# EAGLE design board (EAGLE 9.6.2)
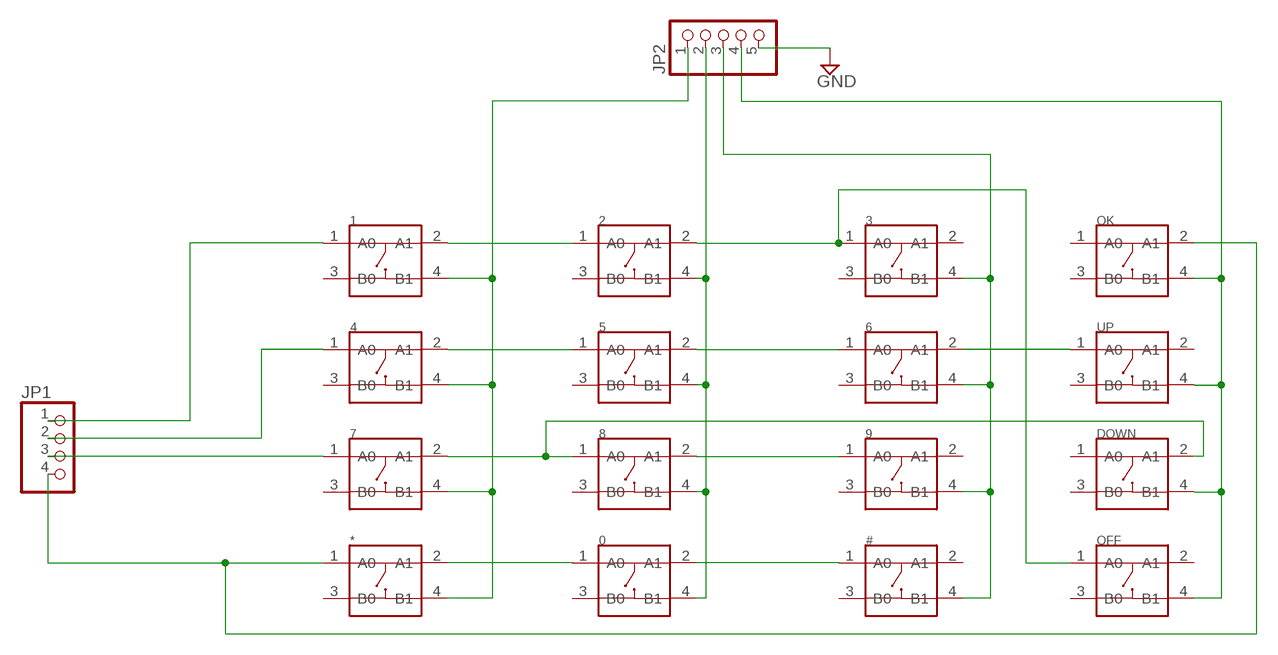
[diagram p0: schematic, sheet 1]

## Parts
0  SMD-BUTTON(4P-4.0X4.0X1.7MM)-DHT-1152  [SW4-SMD-4.0X4.0X1.7MM]
1  SMD-BUTTON(4P-4.0X4.0X1.7MM)-DHT-1152  [SW4-SMD-4.0X4.0X1.7MM]
2  SMD-BUTTON(4P-4.0X4.0X1.7MM)-DHT-1152  [SW4-SMD-4.0X4.0X1.7MM]
3  SMD-BUTTON(4P-4.0X4.0X1.7MM)-DHT-1152  [SW4-SMD-4.0X4.0X1.7MM]
4  SMD-BUTTON(4P-4.0X4.0X1.7MM)-DHT-1152  [SW4-SMD-4.0X4.0X1.7MM]
5  SMD-BUTTON(4P-4.0X4.0X1.7MM)-DHT-1152  [SW4-SMD-4.0X4.0X1.7MM]
6  SMD-BUTTON(4P-4.0X4.0X1.7MM)-DHT-1152  [SW4-SMD-4.0X4.0X1.7MM]
7  SMD-BUTTON(4P-4.0X4.0X1.7MM)-DHT-1152  [SW4-SMD-4.0X4.0X1.7MM]
8  SMD-BUTTON(4P-4.0X4.0X1.7MM)-DHT-1152  [SW4-SMD-4.0X4.0X1.7MM]
9  SMD-BUTTON(4P-4.0X4.0X1.7MM)-DHT-1152  [SW4-SMD-4.0X4.0X1.7MM]
#  SMD-BUTTON(4P-4.0X4.0X1.7MM)-DHT-1152  [SW4-SMD-4.0X4.0X1.7MM]
*  SMD-BUTTON(4P-4.0X4.0X1.7MM)-DHT-1152  [SW4-SMD-4.0X4.0X1.7MM]
DOWN  SMD-BUTTON(4P-4.0X4.0X1.7MM)-DHT-1152  [SW4-SMD-4.0X4.0X1.7MM]
JP1  PINHD-1X4  [1X04]
JP2  PINHD-1X5  [1X05]
OFF  SMD-BUTTON(4P-4.0X4.0X1.7MM)-DHT-1152  [SW4-SMD-4.0X4.0X1.7MM]
OK  SMD-BUTTON(4P-4.0X4.0X1.7MM)-DHT-1152  [SW4-SMD-4.0X4.0X1.7MM]
UP  SMD-BUTTON(4P-4.0X4.0X1.7MM)-DHT-1152  [SW4-SMD-4.0X4.0X1.7MM]

## Nets
GND: JP2.5
N$1: 1.2(A1) 2.1(A0)
N$2: 2.2(A1) 3.1(A0) OFF.1(A0)
N$3: 8.2(A1) 9.1(A0)
N$4: 4.2(A1) 5.1(A0)
N$5: 5.2(A1) 6.1(A0)
N$6: 6.2(A1) UP.1(A0)
N$7: *.1(A0) JP1.4 OK.2(A1)
N$8: 7.2(A1) 8.1(A0) DOWN.2(A1)
N$11: 0.2(A1) #.1(A0)
N$12: 0.1(A0) *.2(A1)
N$13: 1.4(B1) 4.4(B1) 7.4(B1) *.4(B1) JP2.1
N$15: 7.1(A0) JP1.3
N$16: 4.1(A0) JP1.2
N$17: 1.1(A0) JP1.1
N$19: 0.4(B1) 2.4(B1) 5.4(B1) 8.4(B1) JP2.2
N$20: 3.4(B1) 6.4(B1) 9.4(B1) #.4(B1) JP2.3
PLATE: DOWN.4(B1) JP2.4 OFF.4(B1) OK.4(B1) UP.4(B1)
Unconnected: 0.3(B0) 1.3(B0) 2.3(B0) 3.2(A1) 3.3(B0) 4.3(B0) 5.3(B0) 6.3(B0) 7.3(B0) 8.3(B0) 9.2(A1) 9.3(B0) #.2(A1) #.3(B0) *.3(B0) DOWN.1(A0) DOWN.3(B0) OFF.2(A1) OFF.3(B0) OK.1(A0) OK.3(B0) UP.2(A1) UP.3(B0)

## Library data of the parts
0 1-9 # * DOWN OFF OK UP = Seeed-OPL-Switch:SMD-BUTTON(4P-4.0X4.0X1.7MM): 311020027
JP1 = pinhead:PINHD-1X4: PIN HEADER
JP2 = pinhead:PINHD-1X5: PIN HEADER

## Board
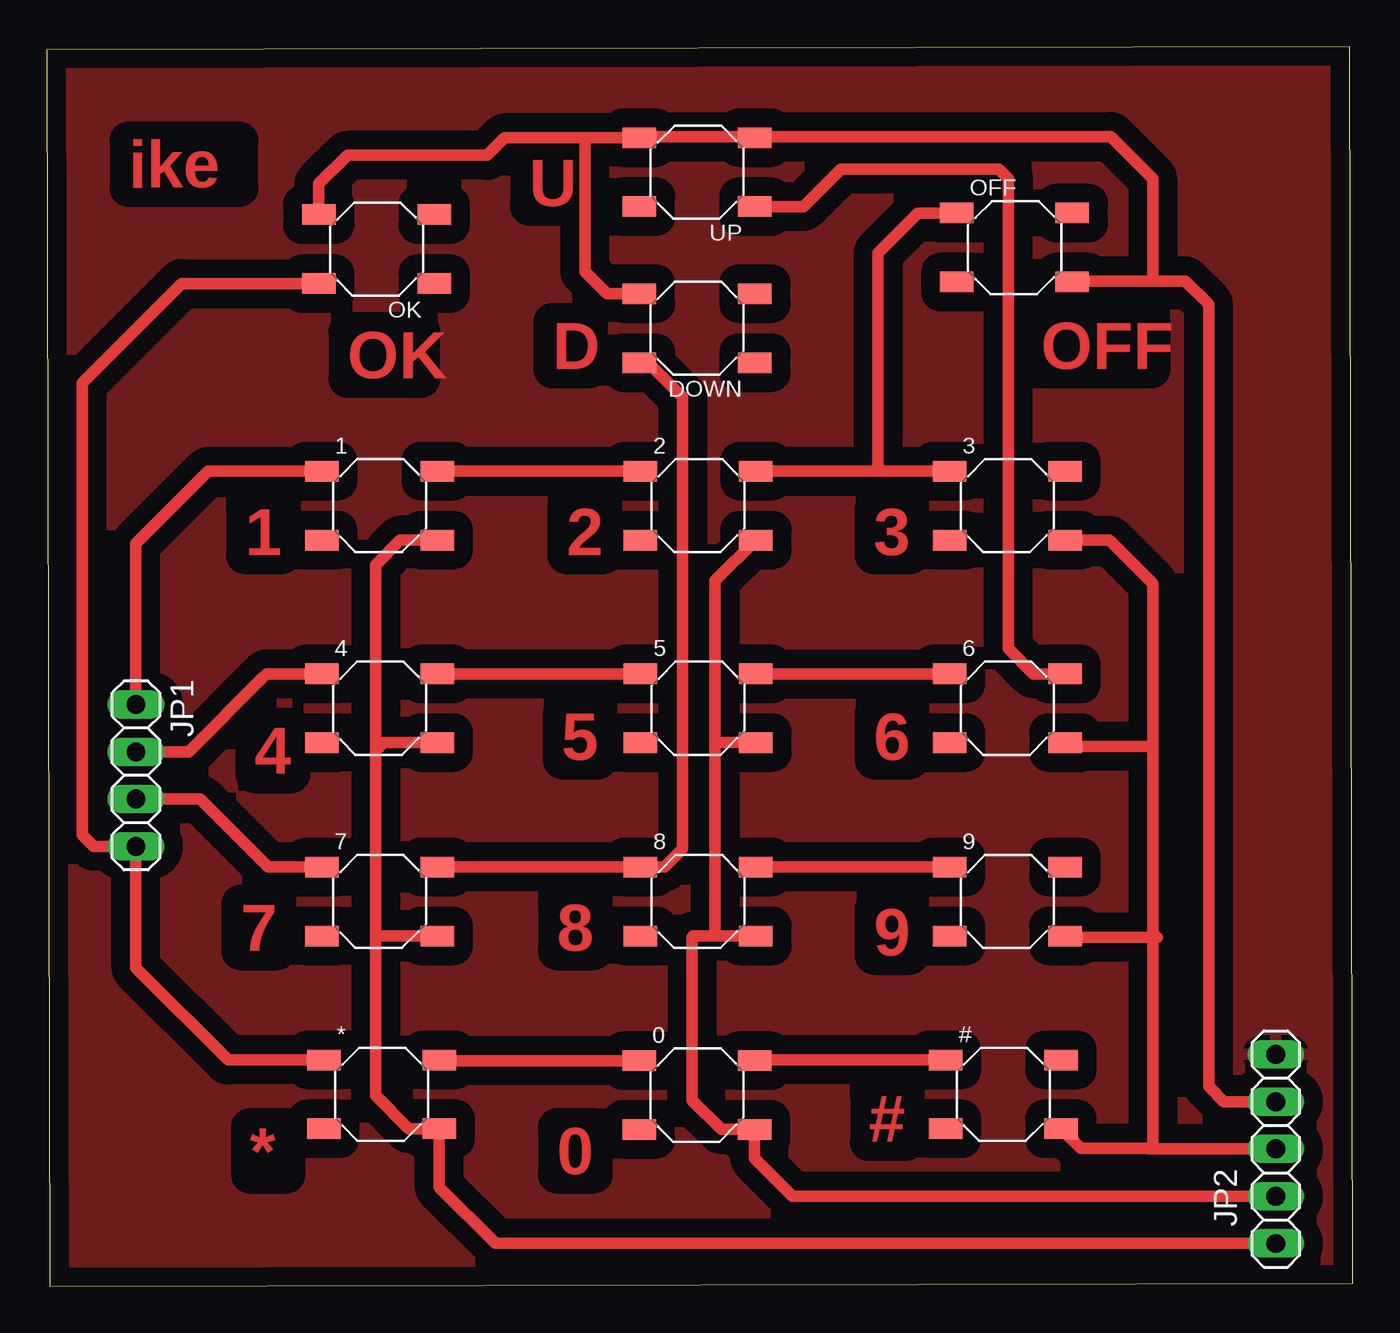
[diagram p1: board, top side]

Size 70.16 x 66.59 mm. Coordinates in mm from the lower left corner, seen from the top.
Outline: 0.16,0 70.16,0.16 70,66.59 0,66.43 0.16,0
Copper layers (1*16): Top 0.035mm / dielectric 1.5mm / Bottom 0.035mm
Design rules "default": minimum track width 6mil, minimum drill 0.35mm, track to track 6mil, track to pad 6mil, pad to pad 6mil, via to via 6mil, smd to smd 6mil, copper to edge 40mil, drill to drill 6mil, minimum pad ring 10mil, minimum via ring 8mil, stop-mask expansion 4mil, vias tented up to drill 0mil, thermal gap 10mil

### Footprints (pad centres in the part's own frame; a part is rotated, then mirrored left to right if it is on the bottom)
SW4-SMD-4.0X4.0X1.7MM = smd 1.8 x 1.1: 1 -3.1,1.85; 2 3.1,1.85; 3 -3.1,-1.85; 4 3.1,-1.85
1X04 = drill 1.016 long: 1 -3.81,0; 2 -1.27,0; 3 1.27,0; 4 3.81,0
1X05 = drill 1.016 long: 1 -5.08,0; 2 -2.54,0; 3 0,0; 4 2.54,0; 5 5.08,0

### Placement (x,y rotation side)
0  34.93,10.27 0 top
1  17.88,41.93 0 top
2  34.99,41.93 0 top
3  51.6,41.93 0 top
4  17.88,31.05 0 top
5  34.99,31.05 0 top
6  51.6,31.05 0 top
7  17.88,20.67 0 top
8  34.99,20.67 0 top
9  51.6,20.67 0 top
#  51.38,10.31 0 top
*  17.99,10.31 0 top
DOWN  34.94,51.46 180 top
JP1  4.8,27.44 270 top
JP2  66.02,7.38 90 top
OFF  51.99,55.79 0 top
OK  17.72,55.71 180 top
UP  34.94,59.84 180 top

### Tracks (layer width: path | path; a pad name or v marks a point on that pad's centre or on a via)
GND
  pour Top (isolate 1.016): 0.16,67 70.66,67 70.66,0 0.16,0
N$1
  Top 0.61: 1.2 2.1
N$2
  Top 0.61: 2.2 44.66,43.78 | 44.66,43.78 3.1 | OFF.1 46.8,57.64 44.66,55.5 44.66,43.78
N$3
  Top 0.61: 9.1 8.2
N$4
  Top 0.61: 5.1 4.2
N$5
  Top 0.61: 5.2 6.1
N$6
  Top 0.61: 6.2 53.01,32.9 51.66,34.25 51.66,59.5 51.16,60 42.66,60 40.65,57.99 UP.1
N$7
  Top 0.61: *.1 9.75,12.16 4.8,17.11 JP1.4 2.53,23.63 1.91,24.25 1.91,48.5 7.27,53.86 OK.2
N$8
  Top 0.61: 7.2 8.1 33.18,22.52 34.16,23.5 34.16,47.75 32.3,49.61 DOWN.2
N$11
  Top 0.61: #.1 38.07,12.16 0.2
N$12
  Top 0.61: 0.1 21.13,12.12 *.2
N$13
  Top 0.61: 1.4 18.99,40.08 17.66,38.75 17.66,28.75 | 17.66,28.75 17.66,19 | 17.66,19 17.66,10.25 19.45,8.46 *.4 21.09,5.32 24.11,2.3 JP2.1 | 4.4 18.11,29.2 17.66,28.75 | 7.4 17.84,18.82 17.66,19
N$15
  Top 0.61: 7.1 11.89,22.52 8.24,26.17 JP1.3
N$16
  Top 0.61: 4.1 11.81,32.9 11.66,32.75 7.62,28.71 JP1.2
N$17
  Top 0.61: JP1.1 4.8,39.89 8.69,43.78 1.1
N$19
  Top 0.61: 8.4 35.91,18.82 | 35.91,18.82 34.73,18.82 34.66,18.75 34.66,10 36.24,8.42 0.4 38.03,6.88 40.07,4.84 JP2.2 | 2.4 35.91,37.9 35.91,29.25 | 35.91,29.25 35.91,18.82 | 5.4 35.96,29.2 35.91,29.25
N$20
  Top 0.61: 59.16,7.4 59.41,7.4 59.41,19 | 59.16,7.4 55.54,7.4 #.4 | 3.4 57.08,40.08 59.41,37.75 59.41,29 | 59.41,29 54.9,29 6.4 | 59.41,29 59.41,19 | 59.41,19 59.66,18.75 54.77,18.75 9.4 | JP2.3 59.18,7.38 59.16,7.4
PLATE
  Top 0.61: 59.41,54 55.15,54 OFF.4 | 59.41,54 59.41,59.5 57.16,61.75 31.9,61.75 UP.4 28.91,61.69 | OK.4 14.62,59.21 16.16,60.75 23.66,60.75 24.6,61.69 28.91,61.69 | DOWN.4 30.1,53.31 28.91,54.5 28.91,61.69 | JP2.4 63.24,9.92 62.41,10.75 62.41,52.75 61.16,54 59.41,54

### Text on the board
Top: ike | U | OK | D | OFF | 1 | 2 | 3 | 4 | 5 | 6 | 7 | 8 | 9 | # | * | 0